# Altium schematic sheet UI.SchDoc
size C; SheetNumber: 5; SheetTotal: 5
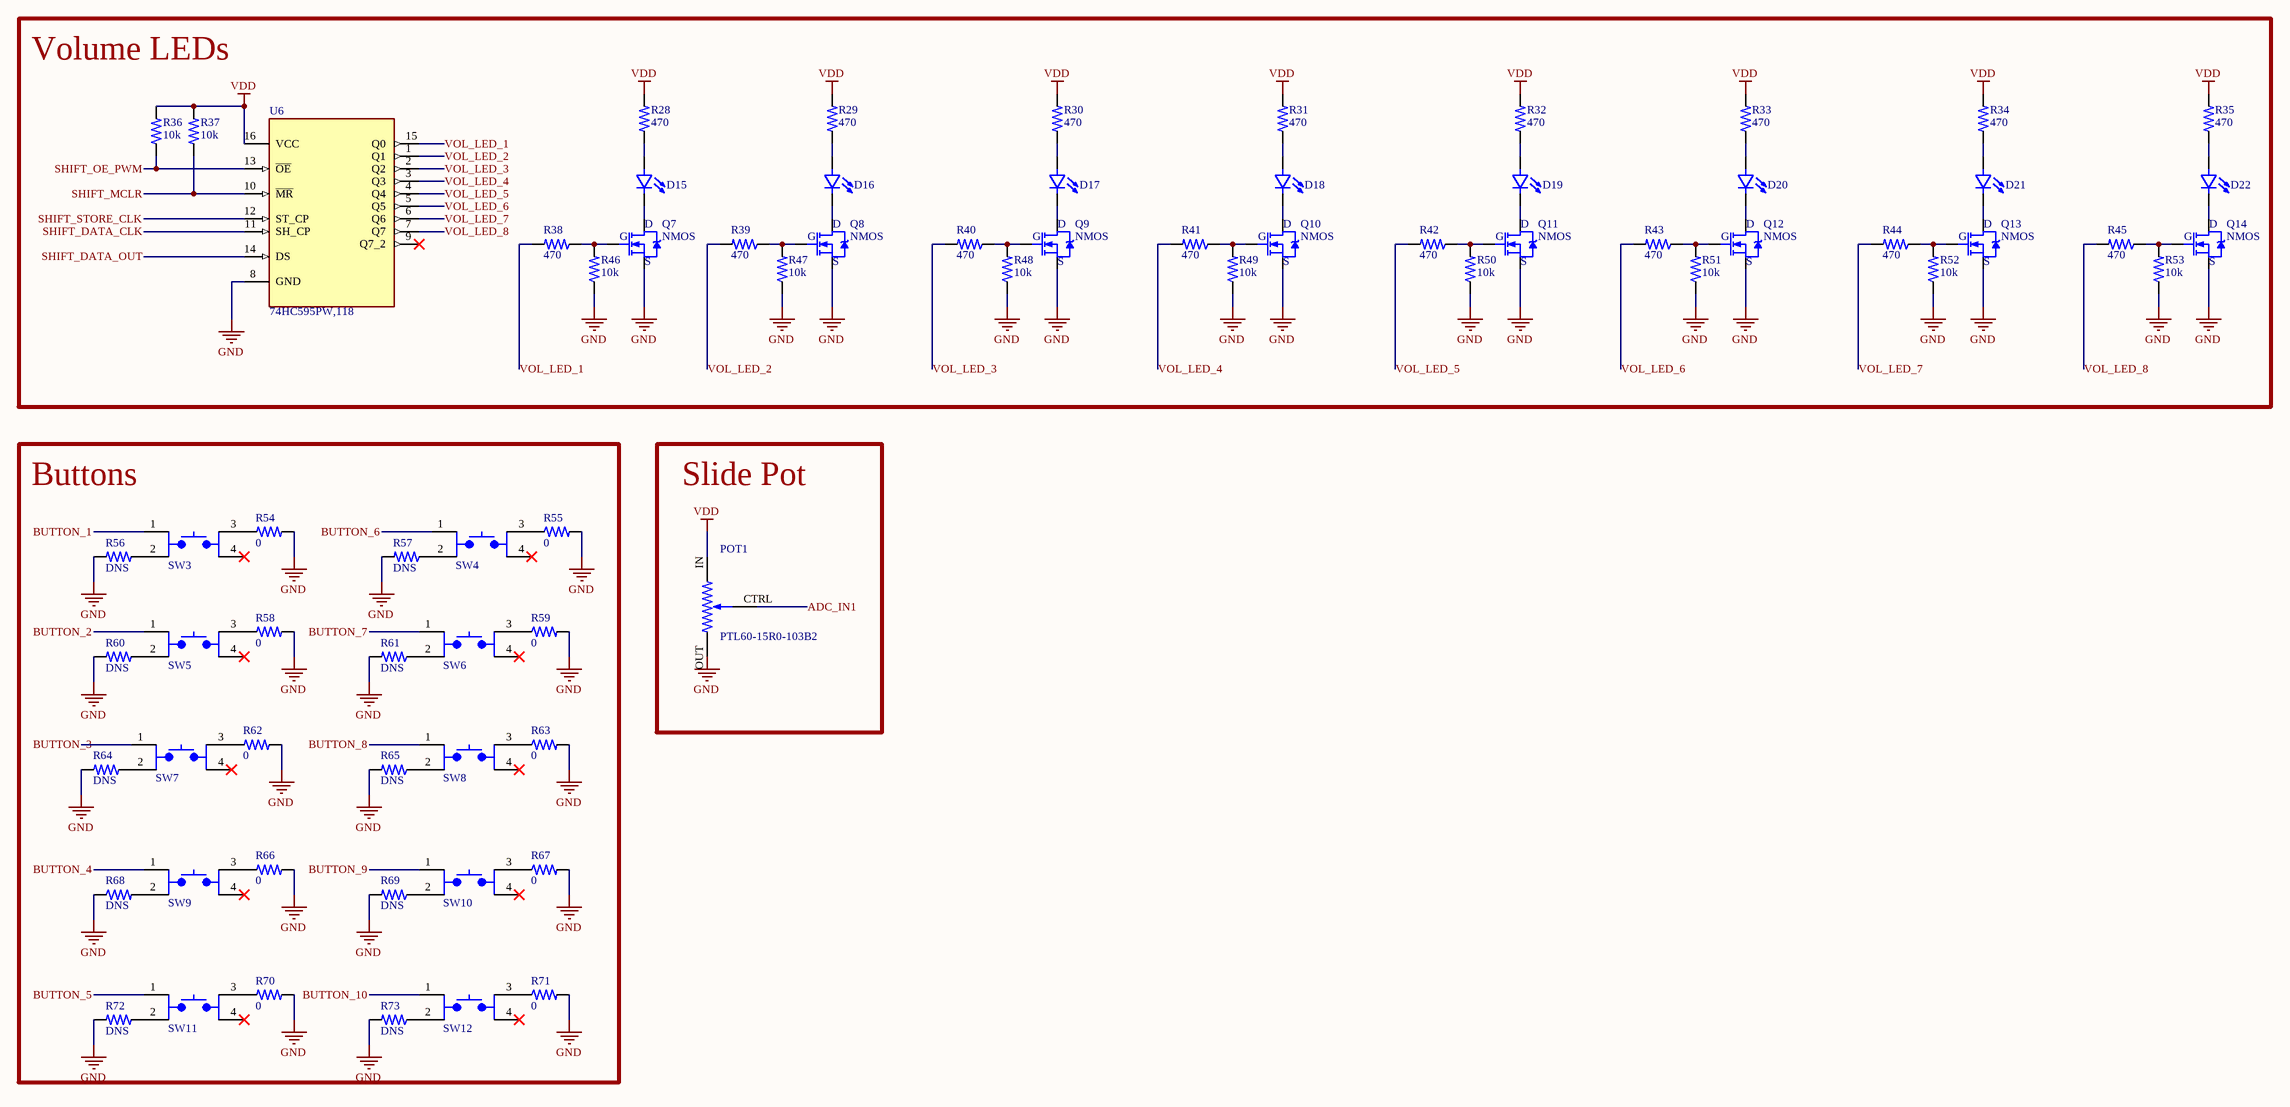
[diagram p0: UI.SchDoc]

## Parts
D15  LED - single  [0603-LED]  (value not drawn)
D16  LED - single  [0603-LED]  (value not drawn)
D17  LED - single  [0603-LED]  (value not drawn)
D18  LED - single  [0603-LED]  (value not drawn)
D19  LED - single  [0603-LED]  (value not drawn)
D20  LED - single  [0603-LED]  (value not drawn)
D21  LED - single  [0603-LED]  (value not drawn)
D22  LED - single  [0603-LED]  (value not drawn)
POT1  PTL60-15R0-103B2  [BIG SLIDE POT]
Q7  NMOS  [SOT-23]
Q8  NMOS  [SOT-23]
Q9  NMOS  [SOT-23]
Q10  NMOS  [SOT-23]
Q11  NMOS  [SOT-23]
Q12  NMOS  [SOT-23]
Q13  NMOS  [SOT-23]
Q14  NMOS  [SOT-23]
R28  value 470  [0603-RES]  (hidden comment: RES)
R29  value 470  [0603-RES]  (hidden comment: RES)
R30  value 470  [0603-RES]  (hidden comment: RES)
R31  value 470  [0603-RES]  (hidden comment: RES)
R32  value 470  [0603-RES]  (hidden comment: RES)
R33  value 470  [0603-RES]  (hidden comment: RES)
R34  value 470  [0603-RES]  (hidden comment: RES)
R35  value 470  [0603-RES]  (hidden comment: RES)
R36  value 10k  [0603-RES]  (hidden comment: RES)
R37  value 10k  [0603-RES]  (hidden comment: RES)
R38  value 470  [0603-RES]  (hidden comment: RES)
R39  value 470  [0603-RES]  (hidden comment: RES)
R40  value 470  [0603-RES]  (hidden comment: RES)
R41  value 470  [0603-RES]  (hidden comment: RES)
R42  value 470  [0603-RES]  (hidden comment: RES)
R43  value 470  [0603-RES]  (hidden comment: RES)
R44  value 470  [0603-RES]  (hidden comment: RES)
R45  value 470  [0603-RES]  (hidden comment: RES)
R46  value 10k  [0603-RES]  (hidden comment: RES)
R47  value 10k  [0603-RES]  (hidden comment: RES)
R48  value 10k  [0603-RES]  (hidden comment: RES)
R49  value 10k  [0603-RES]  (hidden comment: RES)
R50  value 10k  [0603-RES]  (hidden comment: RES)
R51  value 10k  [0603-RES]  (hidden comment: RES)
R52  value 10k  [0603-RES]  (hidden comment: RES)
R53  value 10k  [0603-RES]  (hidden comment: RES)
R54  value 0  [0603-RES]  (hidden comment: RES)
R55  value 0  [0603-RES]  (hidden comment: RES)
R56  value DNS  [0603-RES]  (hidden comment: RES)
R57  value DNS  [0603-RES]  (hidden comment: RES)
R58  value 0  [0603-RES]  (hidden comment: RES)
R59  value 0  [0603-RES]  (hidden comment: RES)
R60  value DNS  [0603-RES]  (hidden comment: RES)
R61  value DNS  [0603-RES]  (hidden comment: RES)
R62  value 0  [0603-RES]  (hidden comment: RES)
R63  value 0  [0603-RES]  (hidden comment: RES)
R64  value DNS  [0603-RES]  (hidden comment: RES)
R65  value DNS  [0603-RES]  (hidden comment: RES)
R66  value 0  [0603-RES]  (hidden comment: RES)
R67  value 0  [0603-RES]  (hidden comment: RES)
R68  value DNS  [0603-RES]  (hidden comment: RES)
R69  value DNS  [0603-RES]  (hidden comment: RES)
R70  value 0  [0603-RES]  (hidden comment: RES)
R71  value 0  [0603-RES]  (hidden comment: RES)
R72  value DNS  [0603-RES]  (hidden comment: RES)
R73  value DNS  [0603-RES]  (hidden comment: RES)
SW3  SPDT SMT Tactile Push Button Switch  [TACTILE SWITCH]  (value not drawn)
SW4  SPDT SMT Tactile Push Button Switch  [TACTILE SWITCH]  (value not drawn)
SW5  SPDT SMT Tactile Push Button Switch  [TACTILE SWITCH]  (value not drawn)
SW6  SPDT SMT Tactile Push Button Switch  [TACTILE SWITCH]  (value not drawn)
SW7  SPDT SMT Tactile Push Button Switch  [TACTILE SWITCH]  (value not drawn)
SW8  SPDT SMT Tactile Push Button Switch  [TACTILE SWITCH]  (value not drawn)
SW9  SPDT SMT Tactile Push Button Switch  [TACTILE SWITCH]  (value not drawn)
SW10  SPDT SMT Tactile Push Button Switch  [TACTILE SWITCH]  (value not drawn)
SW11  SPDT SMT Tactile Push Button Switch  [TACTILE SWITCH]  (value not drawn)
SW12  SPDT SMT Tactile Push Button Switch  [TACTILE SWITCH]  (value not drawn)
U6  74HC595PW,118  [16-TSSOP]

## Blocks framed on the sheet
Volume LEDs: D15-D22 Q7-Q14 R28-R53 U6
Buttons: R54-R73 SW3-SW12
Slide Pot: POT1

## Nets
GND: POT1.OUT(FINAL) Q7.2(S) Q8.2(S) Q9.2(S) Q10.2(S) Q11.2(S) Q12.2(S) Q13.2(S) Q14.2(S) R46.1 R47.1 R48.1 R49.1 R50.1 R51.1 R52.1 R53.1 R54.2 R55.2 R56.2 R57.2 R58.2 R59.2 R60.2 R61.2 R62.2 R63.2 R64.2 R65.2 R66.2 R67.2 R68.1 R69.2 R70.2 R71.2 R72.2 R73.2 U6.8(GND)
VDD: POT1.IN(INITIAL) R28.2 R29.2 R30.2 R31.2 R32.2 R33.2 R34.2 R35.2 R36.2 R37.2 U6.16(VCC)
ADC_IN1: POT1.CTRL(WIPER)
BUTTON_1: SW3.1
BUTTON_2: SW5.1
BUTTON_3: SW7.1
BUTTON_4: SW9.1
BUTTON_5: SW11.1
BUTTON_6: SW4.1
BUTTON_7: SW6.1
BUTTON_8: SW8.1
BUTTON_9: SW10.1
BUTTON_10: SW12.1
SHIFT_DATA_CLK: U6.11(SH_CP)
SHIFT_DATA_OUT: U6.14(DS)
SHIFT_MCLR: R37.1 U6.10(~{MR})
SHIFT_OE_PWM: R36.1 U6.13(~{OE})
SHIFT_STORE_CLK: U6.12(ST_CP)
VOL_LED_1: R38.2 U6.15(Q0)
VOL_LED_2: R39.2 U6.1(Q1)
VOL_LED_3: R40.2 U6.2(Q2)
VOL_LED_4: R41.2 U6.3(Q3)
VOL_LED_5: R42.2 U6.4(Q4)
VOL_LED_6: R43.2 U6.5(Q5)
VOL_LED_7: R44.2 U6.6(Q6)
VOL_LED_8: R45.2 U6.7(Q7)
NetD15_1: D15.1(A) R28.1
NetD15_2: D15.2(C) Q7.3(D)
NetD16_1: D16.1(A) R29.1
NetD16_2: D16.2(C) Q8.3(D)
NetD17_1: D17.1(A) R30.1
NetD17_2: D17.2(C) Q9.3(D)
NetD18_1: D18.1(A) R31.1
NetD18_2: D18.2(C) Q10.3(D)
NetD19_1: D19.1(A) R32.1
NetD19_2: D19.2(C) Q11.3(D)
NetD20_1: D20.1(A) R33.1
NetD20_2: D20.2(C) Q12.3(D)
NetD21_1: D21.1(A) R34.1
NetD21_2: D21.2(C) Q13.3(D)
NetD22_1: D22.1(A) R35.1
NetD22_2: D22.2(C) Q14.3(D)
NetQ7_1: Q7.1(G) R38.1 R46.2
NetQ8_1: Q8.1(G) R39.1 R47.2
NetQ9_1: Q9.1(G) R40.1 R48.2
NetQ10_1: Q10.1(G) R41.1 R49.2
NetQ11_1: Q11.1(G) R42.1 R50.2
NetQ12_1: Q12.1(G) R43.1 R51.2
NetQ13_1: Q13.1(G) R44.1 R52.2
NetQ14_1: Q14.1(G) R45.1 R53.2
NetR54_1: R54.1 SW3.3
NetR55_1: R55.1 SW4.3
NetR56_1: R56.1 SW3.2
NetR57_1: R57.1 SW4.2
NetR58_1: R58.1 SW5.3
NetR59_1: R59.1 SW6.3
NetR60_1: R60.1 SW5.2
NetR61_1: R61.1 SW6.2
NetR62_1: R62.1 SW7.3
NetR63_1: R63.1 SW8.3
NetR64_1: R64.1 SW7.2
NetR65_1: R65.1 SW8.2
NetR66_1: R66.1 SW9.3
NetR67_1: R67.1 SW10.3
NetR68_2: R68.2 SW9.2
NetR69_1: R69.1 SW10.2
NetR70_1: R70.1 SW11.3
NetR71_1: R71.1 SW12.3
NetR72_1: R72.1 SW11.2
NetR73_1: R73.1 SW12.2

Not connected (* = marked no-connect by the designer): SW3 4*; SW4 4*; SW5 4*; SW6 4*; SW7 4*; SW8 4*; SW9 4*; SW10 4*; SW11 4*; SW12 4*; U6 9(Q7_2)*

## Library data of the parts
D15 D17 D19 D21 = LED - single: LED; MFR: Everlight Elec; MFR PN: 19-217/GHC-YR1S2/3T; Color: Green; Type: SMD
D16 D18 D20 D22 = LED - single: LED; MFR: Hubei KENTO Elec; MFR PN: KT-0603R; Color: Red; Type: SMD
POT1 = POT: POT 470 OHM 1/10W CARBON LINEAR; MFR: Bourns Inc.; Value: 10k; MFR PN: PTL60-15R0-103B2
Q7-Q14 = NMOS: N-Channel MOSFET; MFR PN: DMN63D8L; MFR: Diodes Incorporated; Type: SMD
R28-R73 = RES: Resistor; MFR PN: *; MFR: *; Type: SMD
SW3-SW12 = SPDT SMT Tactile Push Button Switch: MFR: TE Connectivity ALCOSWITCH Switches; MFR PN: FSM8JSMASTR; Type: SMD
U6 = SHIFT REGISTER 8 BIT: Shift Shift Register 1 Element 8 Bit 16-TSSOP; MFR: Nexperia USA Inc.; MFR PN: 74HC595PW,118; Type: SMD